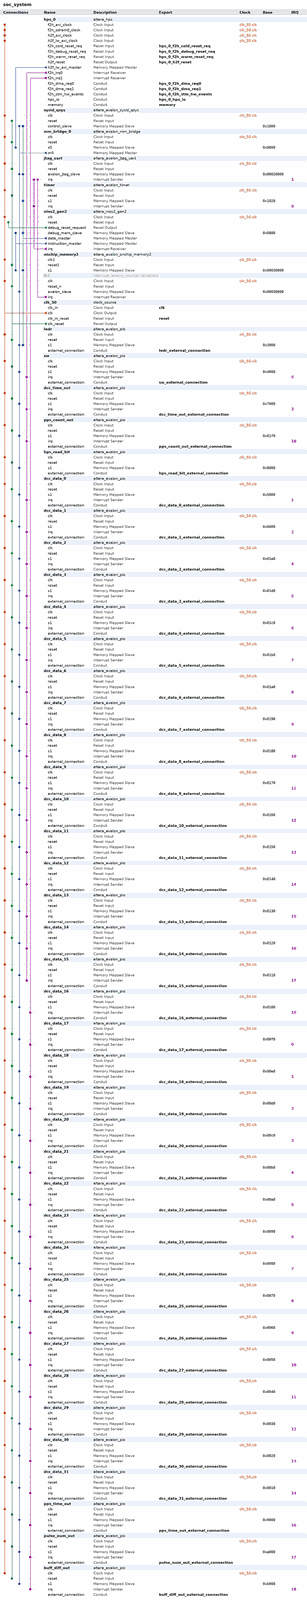
[diagram p0: system contents, whole]
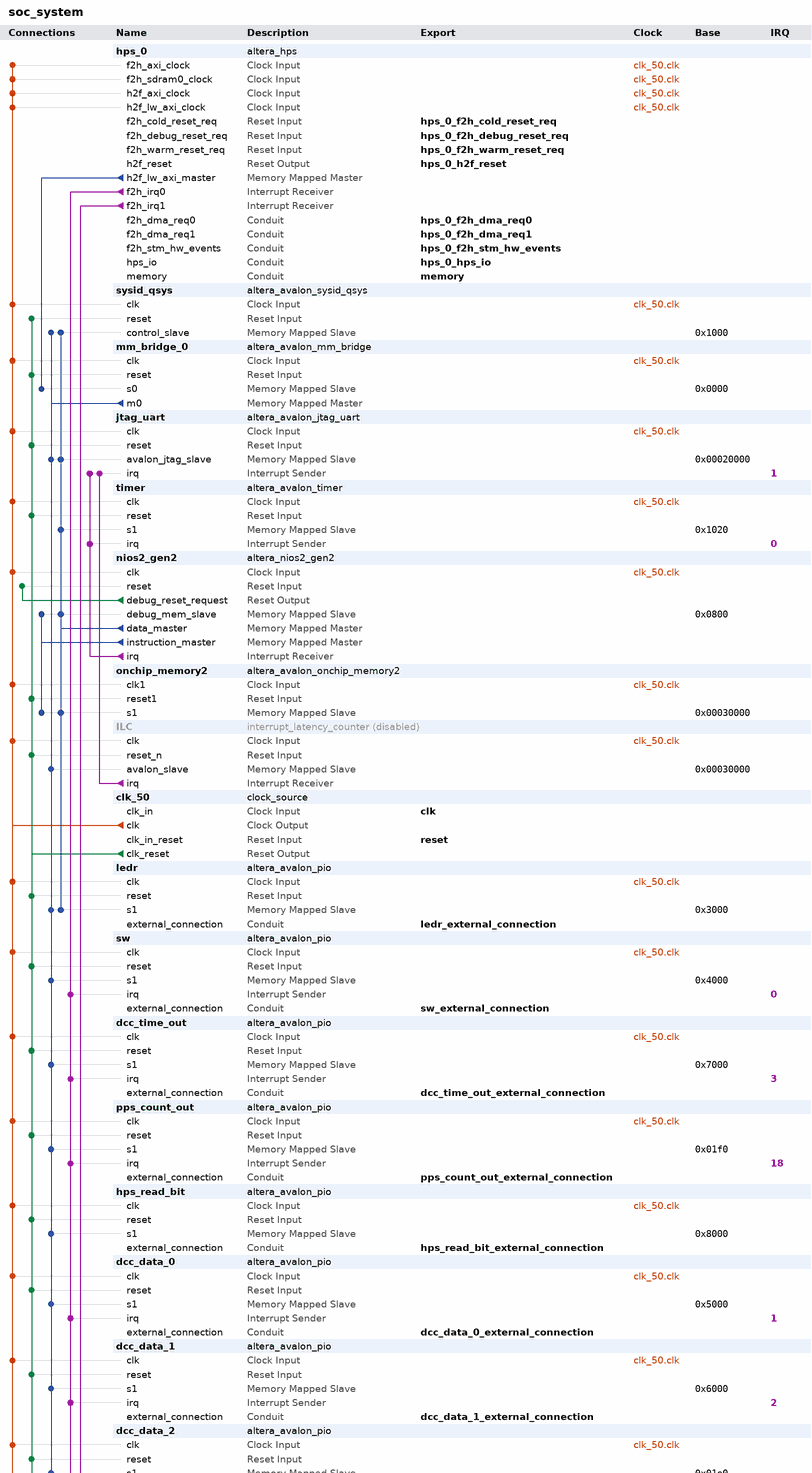
[diagram p1: system contents, upper part]
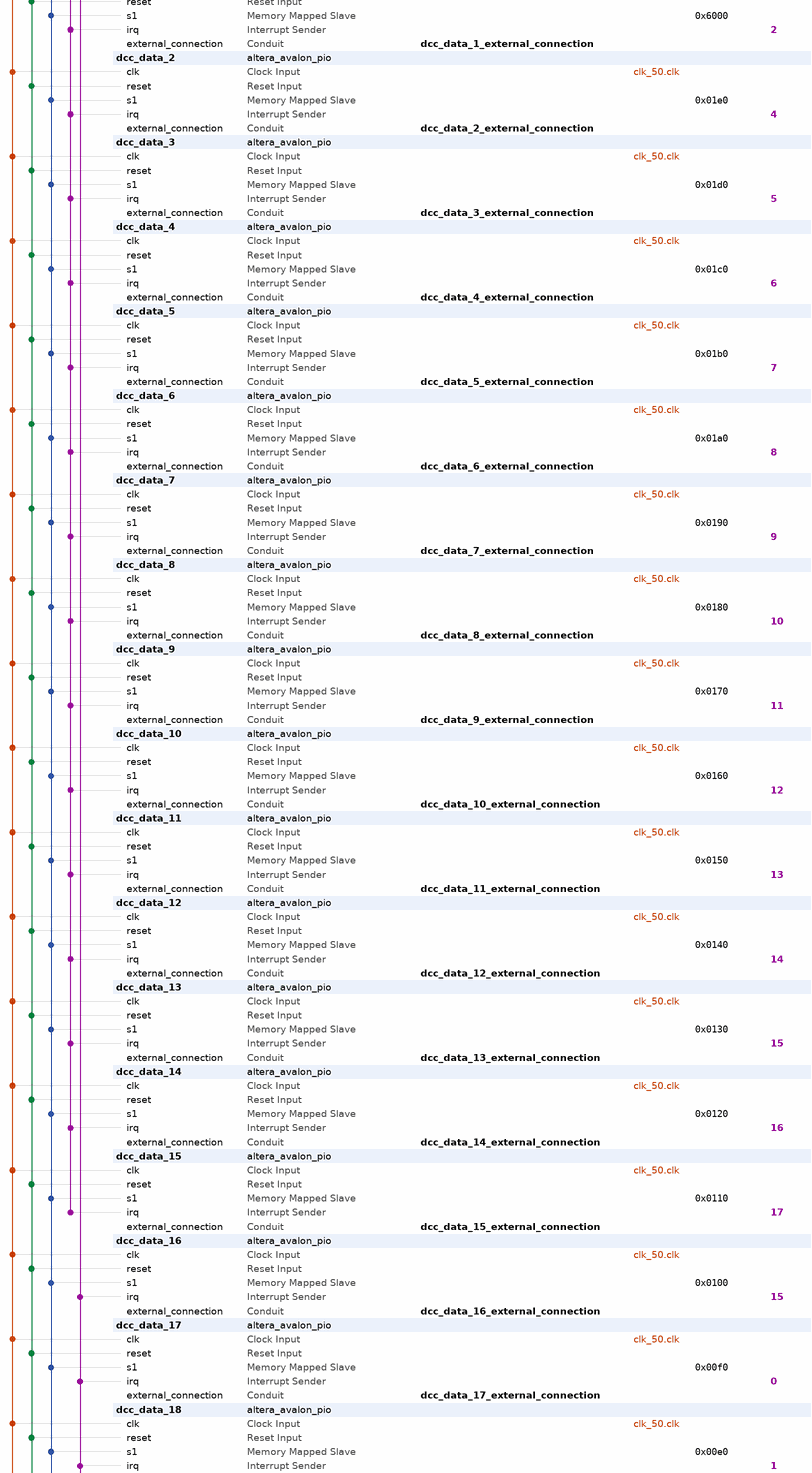
[diagram p2: system contents, middle part]
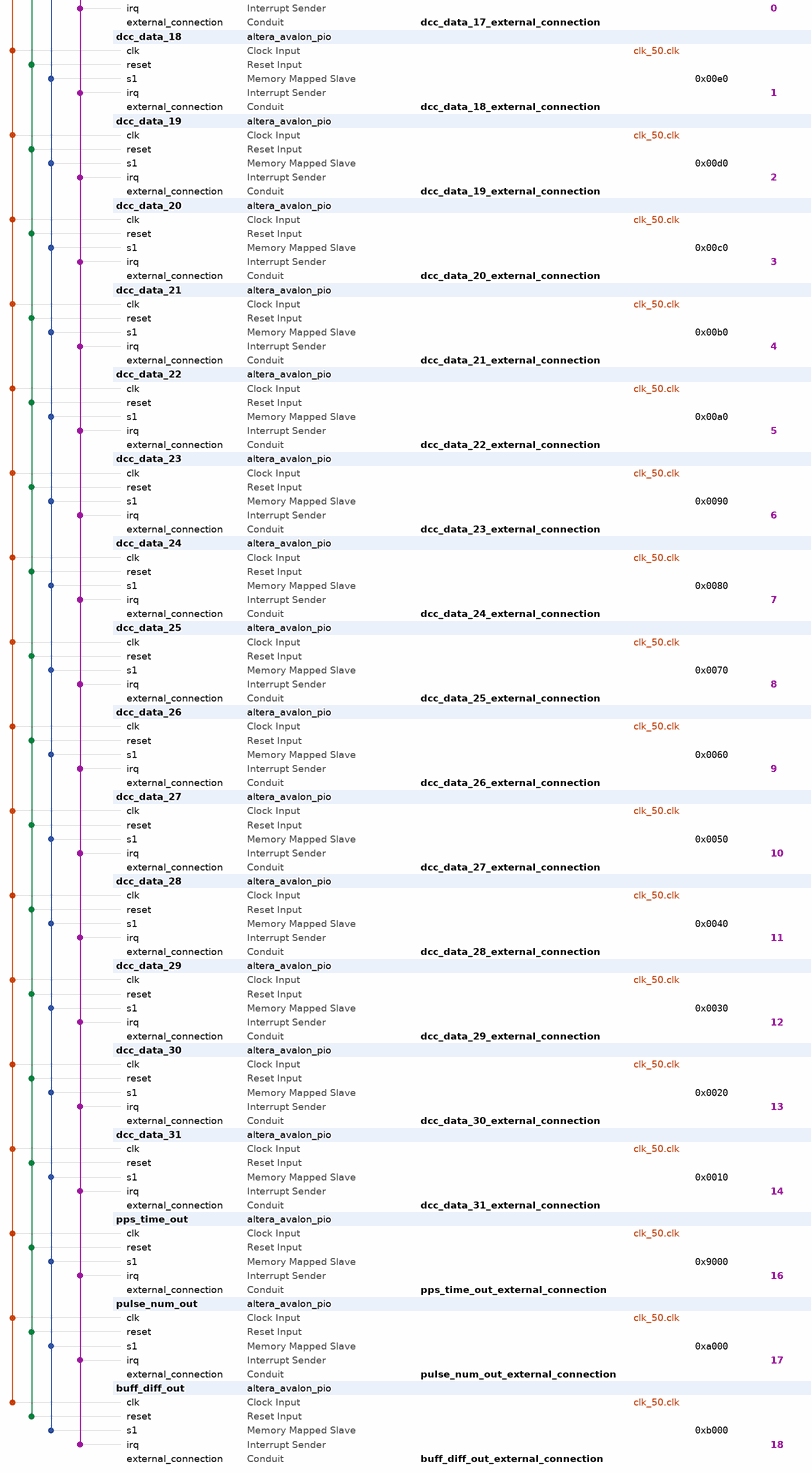
[diagram p3: system contents, lower part]
# Platform Designer (Qsys) system soc_system, Cyclone V 5CSXFC6D6F31C6
# Parameters at their usual value, and those the tool derives, are not listed.
package require -exact qsys 18.1
create_system soc_system
set_project_property DEVICE_FAMILY {Cyclone V}
set_project_property DEVICE 5CSXFC6D6F31C6

add_instance hps_0 altera_hps 18.1
set_instance_parameter_value hps_0 DMA_Enable Yes,Yes,No,No,No,No,No,No
set_instance_parameter_value hps_0 EMAC1_Mode RGMII
set_instance_parameter_value hps_0 EMAC1_PinMuxing {HPS I/O Set 0}
set_instance_parameter_value hps_0 F2SCLK_COLDRST_Enable true
set_instance_parameter_value hps_0 F2SCLK_DBGRST_Enable true
set_instance_parameter_value hps_0 F2SCLK_WARMRST_Enable true
set_instance_parameter_value hps_0 F2SDRAM_Type {Avalon-MM Bidirectional}
set_instance_parameter_value hps_0 F2SDRAM_Width 256
set_instance_parameter_value hps_0 F2SINTERRUPT_Enable true
set_instance_parameter_value hps_0 F2S_Width 3
set_instance_parameter_value hps_0 FPGA_PERIPHERAL_OUTPUT_CLOCK_FREQ_EMAC0_GTX_CLK 100
set_instance_parameter_value hps_0 FPGA_PERIPHERAL_OUTPUT_CLOCK_FREQ_EMAC0_MD_CLK 100.0
set_instance_parameter_value hps_0 FPGA_PERIPHERAL_OUTPUT_CLOCK_FREQ_EMAC1_GTX_CLK 100
set_instance_parameter_value hps_0 FPGA_PERIPHERAL_OUTPUT_CLOCK_FREQ_EMAC1_MD_CLK 100.0
set_instance_parameter_value hps_0 HPS_PROTOCOL DDR3
set_instance_parameter_value hps_0 I2C0_Mode I2C
set_instance_parameter_value hps_0 I2C0_PinMuxing {HPS I/O Set 0}
set_instance_parameter_value hps_0 I2C1_Mode I2C
set_instance_parameter_value hps_0 I2C1_PinMuxing {HPS I/O Set 0}
set_instance_parameter_value hps_0 LWH2F_Enable true
set_instance_parameter_value hps_0 MEM_BANKADDR_WIDTH 3
set_instance_parameter_value hps_0 MEM_CLK_FREQ 400.0
set_instance_parameter_value hps_0 MEM_COL_ADDR_WIDTH 10
set_instance_parameter_value hps_0 MEM_DQ_WIDTH 32
set_instance_parameter_value hps_0 MEM_DRV_STR RZQ/6
set_instance_parameter_value hps_0 MEM_ROW_ADDR_WIDTH 15
set_instance_parameter_value hps_0 MEM_RTT_NOM RZQ/6
set_instance_parameter_value hps_0 MEM_RTT_WR {Dynamic ODT off}
set_instance_parameter_value hps_0 MEM_TCL 7
set_instance_parameter_value hps_0 MEM_TFAW_NS 45.0
set_instance_parameter_value hps_0 MEM_TRAS_NS 36.0
set_instance_parameter_value hps_0 MEM_TRCD_NS 13.125
set_instance_parameter_value hps_0 MEM_TRFC_NS 300.0
set_instance_parameter_value hps_0 MEM_TRP_NS 13.125
set_instance_parameter_value hps_0 MEM_VENDOR Micron
set_instance_parameter_value hps_0 MEM_WTCL 7
set_instance_parameter_value hps_0 QSPI_Mode {1 SS}
set_instance_parameter_value hps_0 QSPI_PinMuxing {HPS I/O Set 0}
set_instance_parameter_value hps_0 REF_CLK_FREQ 25.0
set_instance_parameter_value hps_0 S2FCLK_USER2CLK 1
set_instance_parameter_value hps_0 S2F_Width 2
set_instance_parameter_value hps_0 SDIO_Mode {4-bit Data}
set_instance_parameter_value hps_0 SDIO_PinMuxing {HPS I/O Set 0}
set_instance_parameter_value hps_0 SPIM0_Mode {Single Slave Select}
set_instance_parameter_value hps_0 SPIM0_PinMuxing {HPS I/O Set 0}
set_instance_parameter_value hps_0 SPIM1_Mode {Single Slave Select}
set_instance_parameter_value hps_0 SPIM1_PinMuxing {HPS I/O Set 0}
set_instance_parameter_value hps_0 STM_Enable true
set_instance_parameter_value hps_0 TIMING_BOARD_AC_SKEW 0.02
set_instance_parameter_value hps_0 TIMING_BOARD_AC_TO_CK_SKEW 0.01
set_instance_parameter_value hps_0 TIMING_BOARD_DQ_TO_DQS_SKEW 0.05
set_instance_parameter_value hps_0 TIMING_BOARD_MAX_CK_DELAY 0.03
set_instance_parameter_value hps_0 TIMING_BOARD_MAX_DQS_DELAY 0.02
set_instance_parameter_value hps_0 TIMING_BOARD_SKEW_BETWEEN_DQS 0.06
set_instance_parameter_value hps_0 TIMING_BOARD_SKEW_CKDQS_DIMM_MAX 0.12
set_instance_parameter_value hps_0 TIMING_BOARD_SKEW_CKDQS_DIMM_MIN 0.06
set_instance_parameter_value hps_0 TIMING_BOARD_SKEW_WITHIN_DQS 0.01
set_instance_parameter_value hps_0 TIMING_TDH 65
set_instance_parameter_value hps_0 TIMING_TDQSCK 255
set_instance_parameter_value hps_0 TIMING_TDQSQ 125
set_instance_parameter_value hps_0 TIMING_TDS 30
set_instance_parameter_value hps_0 TIMING_TIH 140
set_instance_parameter_value hps_0 TIMING_TIS 190
set_instance_parameter_value hps_0 TIMING_TQSH 0.4
set_instance_parameter_value hps_0 UART0_Mode {No Flow Control}
set_instance_parameter_value hps_0 UART0_PinMuxing {HPS I/O Set 0}
set_instance_parameter_value hps_0 USB1_Mode SDR
set_instance_parameter_value hps_0 USB1_PinMuxing {HPS I/O Set 0}
set_instance_parameter_value hps_0 desired_cfg_clk_mhz 100.0
set_instance_parameter_value hps_0 desired_mpu_clk_mhz 925.0
set_instance_parameter_value hps_0 desired_qspi_clk_mhz 400.0
set_instance_parameter_value hps_0 use_default_mpu_clk false

add_instance sysid_qsys altera_avalon_sysid_qsys 18.1
set_instance_parameter_value sysid_qsys id -1395322110

add_instance mm_bridge_0 altera_avalon_mm_bridge 18.1
set_instance_parameter_value mm_bridge_0 ADDRESS_UNITS SYMBOLS
set_instance_parameter_value mm_bridge_0 ADDRESS_WIDTH 10
set_instance_parameter_value mm_bridge_0 DATA_WIDTH 32
set_instance_parameter_value mm_bridge_0 MAX_PENDING_RESPONSES 4
set_instance_parameter_value mm_bridge_0 USE_AUTO_ADDRESS_WIDTH 1

add_instance jtag_uart altera_avalon_jtag_uart 18.1
set_instance_parameter_value jtag_uart allowMultipleConnections true
set_instance_parameter_value jtag_uart simInteractiveOptions INTERACTIVE_ASCII_OUTPUT

add_instance timer altera_avalon_timer 18.1
set_instance_parameter_value timer period 1
set_instance_parameter_value timer periodUnits MSEC

add_instance nios2_gen2 altera_nios2_gen2 18.1
set_instance_parameter_value nios2_gen2 dcache_size 2048
set_instance_parameter_value nios2_gen2 exceptionSlave onchip_memory2.s1
set_instance_parameter_value nios2_gen2 icache_size 4096
set_instance_parameter_value nios2_gen2 impl Tiny
set_instance_parameter_value nios2_gen2 resetSlave onchip_memory2.s1

add_instance onchip_memory2 altera_avalon_onchip_memory2 18.1
set_instance_parameter_value onchip_memory2 dataWidth 64
set_instance_parameter_value onchip_memory2 dualPort false
set_instance_parameter_value onchip_memory2 initMemContent true
set_instance_parameter_value onchip_memory2 initializationFileName onchip_memory2
set_instance_parameter_value onchip_memory2 memorySize 65536

add_instance ILC interrupt_latency_counter 18.1
set_instance_property ILC ENABLED false

add_instance clk_50 clock_source 18.1
set_instance_parameter_value clk_50 clockFrequency 50000000

add_instance ledr altera_avalon_pio 18.1
set_instance_parameter_value ledr direction Output
set_instance_parameter_value ledr width 10

add_instance sw altera_avalon_pio 18.1
set_instance_parameter_value sw captureEdge true
set_instance_parameter_value sw direction Input
set_instance_parameter_value sw edgeType ANY
set_instance_parameter_value sw generateIRQ true
set_instance_parameter_value sw irqType EDGE
set_instance_parameter_value sw width 14

add_instance dcc_time_out altera_avalon_pio 18.1
set_instance_parameter_value dcc_time_out captureEdge true
set_instance_parameter_value dcc_time_out direction Input
set_instance_parameter_value dcc_time_out generateIRQ true
set_instance_parameter_value dcc_time_out irqType EDGE
set_instance_parameter_value dcc_time_out width 26

add_instance pps_count_out altera_avalon_pio 18.1
set_instance_parameter_value pps_count_out captureEdge true
set_instance_parameter_value pps_count_out direction Input
set_instance_parameter_value pps_count_out generateIRQ true
set_instance_parameter_value pps_count_out irqType EDGE
set_instance_parameter_value pps_count_out width 32

add_instance hps_read_bit altera_avalon_pio 18.1
set_instance_parameter_value hps_read_bit direction Output
set_instance_parameter_value hps_read_bit width 1

add_instance dcc_data_0 altera_avalon_pio 18.1
set_instance_parameter_value dcc_data_0 captureEdge true
set_instance_parameter_value dcc_data_0 direction Input
set_instance_parameter_value dcc_data_0 generateIRQ true
set_instance_parameter_value dcc_data_0 irqType EDGE
set_instance_parameter_value dcc_data_0 width 32

add_instance dcc_data_1 altera_avalon_pio 18.1
set_instance_parameter_value dcc_data_1 captureEdge true
set_instance_parameter_value dcc_data_1 direction Input
set_instance_parameter_value dcc_data_1 generateIRQ true
set_instance_parameter_value dcc_data_1 irqType EDGE
set_instance_parameter_value dcc_data_1 width 32

add_instance dcc_data_2 altera_avalon_pio 18.1
set_instance_parameter_value dcc_data_2 captureEdge true
set_instance_parameter_value dcc_data_2 direction Input
set_instance_parameter_value dcc_data_2 generateIRQ true
set_instance_parameter_value dcc_data_2 irqType EDGE
set_instance_parameter_value dcc_data_2 width 32

add_instance dcc_data_3 altera_avalon_pio 18.1
set_instance_parameter_value dcc_data_3 captureEdge true
set_instance_parameter_value dcc_data_3 direction Input
set_instance_parameter_value dcc_data_3 generateIRQ true
set_instance_parameter_value dcc_data_3 irqType EDGE
set_instance_parameter_value dcc_data_3 width 32

add_instance dcc_data_4 altera_avalon_pio 18.1
set_instance_parameter_value dcc_data_4 captureEdge true
set_instance_parameter_value dcc_data_4 direction Input
set_instance_parameter_value dcc_data_4 generateIRQ true
set_instance_parameter_value dcc_data_4 irqType EDGE
set_instance_parameter_value dcc_data_4 width 32

add_instance dcc_data_5 altera_avalon_pio 18.1
set_instance_parameter_value dcc_data_5 captureEdge true
set_instance_parameter_value dcc_data_5 direction Input
set_instance_parameter_value dcc_data_5 generateIRQ true
set_instance_parameter_value dcc_data_5 irqType EDGE
set_instance_parameter_value dcc_data_5 width 32

add_instance dcc_data_6 altera_avalon_pio 18.1
set_instance_parameter_value dcc_data_6 captureEdge true
set_instance_parameter_value dcc_data_6 direction Input
set_instance_parameter_value dcc_data_6 generateIRQ true
set_instance_parameter_value dcc_data_6 irqType EDGE
set_instance_parameter_value dcc_data_6 width 32

add_instance dcc_data_7 altera_avalon_pio 18.1
set_instance_parameter_value dcc_data_7 captureEdge true
set_instance_parameter_value dcc_data_7 direction Input
set_instance_parameter_value dcc_data_7 generateIRQ true
set_instance_parameter_value dcc_data_7 irqType EDGE
set_instance_parameter_value dcc_data_7 width 32

add_instance dcc_data_8 altera_avalon_pio 18.1
set_instance_parameter_value dcc_data_8 captureEdge true
set_instance_parameter_value dcc_data_8 direction Input
set_instance_parameter_value dcc_data_8 generateIRQ true
set_instance_parameter_value dcc_data_8 irqType EDGE
set_instance_parameter_value dcc_data_8 width 32

add_instance dcc_data_9 altera_avalon_pio 18.1
set_instance_parameter_value dcc_data_9 captureEdge true
set_instance_parameter_value dcc_data_9 direction Input
set_instance_parameter_value dcc_data_9 generateIRQ true
set_instance_parameter_value dcc_data_9 irqType EDGE
set_instance_parameter_value dcc_data_9 width 32

add_instance dcc_data_10 altera_avalon_pio 18.1
set_instance_parameter_value dcc_data_10 captureEdge true
set_instance_parameter_value dcc_data_10 direction Input
set_instance_parameter_value dcc_data_10 generateIRQ true
set_instance_parameter_value dcc_data_10 irqType EDGE
set_instance_parameter_value dcc_data_10 width 32

add_instance dcc_data_11 altera_avalon_pio 18.1
set_instance_parameter_value dcc_data_11 captureEdge true
set_instance_parameter_value dcc_data_11 direction Input
set_instance_parameter_value dcc_data_11 generateIRQ true
set_instance_parameter_value dcc_data_11 irqType EDGE
set_instance_parameter_value dcc_data_11 width 32

add_instance dcc_data_12 altera_avalon_pio 18.1
set_instance_parameter_value dcc_data_12 captureEdge true
set_instance_parameter_value dcc_data_12 direction Input
set_instance_parameter_value dcc_data_12 generateIRQ true
set_instance_parameter_value dcc_data_12 irqType EDGE
set_instance_parameter_value dcc_data_12 width 32

add_instance dcc_data_13 altera_avalon_pio 18.1
set_instance_parameter_value dcc_data_13 captureEdge true
set_instance_parameter_value dcc_data_13 direction Input
set_instance_parameter_value dcc_data_13 generateIRQ true
set_instance_parameter_value dcc_data_13 irqType EDGE
set_instance_parameter_value dcc_data_13 width 32

add_instance dcc_data_14 altera_avalon_pio 18.1
set_instance_parameter_value dcc_data_14 captureEdge true
set_instance_parameter_value dcc_data_14 direction Input
set_instance_parameter_value dcc_data_14 generateIRQ true
set_instance_parameter_value dcc_data_14 irqType EDGE
set_instance_parameter_value dcc_data_14 width 32

add_instance dcc_data_15 altera_avalon_pio 18.1
set_instance_parameter_value dcc_data_15 captureEdge true
set_instance_parameter_value dcc_data_15 direction Input
set_instance_parameter_value dcc_data_15 generateIRQ true
set_instance_parameter_value dcc_data_15 irqType EDGE
set_instance_parameter_value dcc_data_15 width 32

add_instance dcc_data_16 altera_avalon_pio 18.1
set_instance_parameter_value dcc_data_16 captureEdge true
set_instance_parameter_value dcc_data_16 direction Input
set_instance_parameter_value dcc_data_16 generateIRQ true
set_instance_parameter_value dcc_data_16 irqType EDGE
set_instance_parameter_value dcc_data_16 width 32

add_instance dcc_data_17 altera_avalon_pio 18.1
set_instance_parameter_value dcc_data_17 captureEdge true
set_instance_parameter_value dcc_data_17 direction Input
set_instance_parameter_value dcc_data_17 generateIRQ true
set_instance_parameter_value dcc_data_17 irqType EDGE
set_instance_parameter_value dcc_data_17 width 32

add_instance dcc_data_18 altera_avalon_pio 18.1
set_instance_parameter_value dcc_data_18 captureEdge true
set_instance_parameter_value dcc_data_18 direction Input
set_instance_parameter_value dcc_data_18 generateIRQ true
set_instance_parameter_value dcc_data_18 irqType EDGE
set_instance_parameter_value dcc_data_18 width 32

add_instance dcc_data_19 altera_avalon_pio 18.1
set_instance_parameter_value dcc_data_19 captureEdge true
set_instance_parameter_value dcc_data_19 direction Input
set_instance_parameter_value dcc_data_19 generateIRQ true
set_instance_parameter_value dcc_data_19 irqType EDGE
set_instance_parameter_value dcc_data_19 width 32

add_instance dcc_data_20 altera_avalon_pio 18.1
set_instance_parameter_value dcc_data_20 captureEdge true
set_instance_parameter_value dcc_data_20 direction Input
set_instance_parameter_value dcc_data_20 generateIRQ true
set_instance_parameter_value dcc_data_20 irqType EDGE
set_instance_parameter_value dcc_data_20 width 32

add_instance dcc_data_21 altera_avalon_pio 18.1
set_instance_parameter_value dcc_data_21 captureEdge true
set_instance_parameter_value dcc_data_21 direction Input
set_instance_parameter_value dcc_data_21 generateIRQ true
set_instance_parameter_value dcc_data_21 irqType EDGE
set_instance_parameter_value dcc_data_21 width 32

add_instance dcc_data_22 altera_avalon_pio 18.1
set_instance_parameter_value dcc_data_22 captureEdge true
set_instance_parameter_value dcc_data_22 direction Input
set_instance_parameter_value dcc_data_22 generateIRQ true
set_instance_parameter_value dcc_data_22 irqType EDGE
set_instance_parameter_value dcc_data_22 width 32

add_instance dcc_data_23 altera_avalon_pio 18.1
set_instance_parameter_value dcc_data_23 captureEdge true
set_instance_parameter_value dcc_data_23 direction Input
set_instance_parameter_value dcc_data_23 generateIRQ true
set_instance_parameter_value dcc_data_23 irqType EDGE
set_instance_parameter_value dcc_data_23 width 32

add_instance dcc_data_24 altera_avalon_pio 18.1
set_instance_parameter_value dcc_data_24 captureEdge true
set_instance_parameter_value dcc_data_24 direction Input
set_instance_parameter_value dcc_data_24 generateIRQ true
set_instance_parameter_value dcc_data_24 irqType EDGE
set_instance_parameter_value dcc_data_24 width 32

add_instance dcc_data_25 altera_avalon_pio 18.1
set_instance_parameter_value dcc_data_25 captureEdge true
set_instance_parameter_value dcc_data_25 direction Input
set_instance_parameter_value dcc_data_25 generateIRQ true
set_instance_parameter_value dcc_data_25 irqType EDGE
set_instance_parameter_value dcc_data_25 width 32

add_instance dcc_data_26 altera_avalon_pio 18.1
set_instance_parameter_value dcc_data_26 captureEdge true
set_instance_parameter_value dcc_data_26 direction Input
set_instance_parameter_value dcc_data_26 generateIRQ true
set_instance_parameter_value dcc_data_26 irqType EDGE
set_instance_parameter_value dcc_data_26 width 32

add_instance dcc_data_27 altera_avalon_pio 18.1
set_instance_parameter_value dcc_data_27 captureEdge true
set_instance_parameter_value dcc_data_27 direction Input
set_instance_parameter_value dcc_data_27 generateIRQ true
set_instance_parameter_value dcc_data_27 irqType EDGE
set_instance_parameter_value dcc_data_27 width 32

add_instance dcc_data_28 altera_avalon_pio 18.1
set_instance_parameter_value dcc_data_28 captureEdge true
set_instance_parameter_value dcc_data_28 direction Input
set_instance_parameter_value dcc_data_28 generateIRQ true
set_instance_parameter_value dcc_data_28 irqType EDGE
set_instance_parameter_value dcc_data_28 width 32

add_instance dcc_data_29 altera_avalon_pio 18.1
set_instance_parameter_value dcc_data_29 captureEdge true
set_instance_parameter_value dcc_data_29 direction Input
set_instance_parameter_value dcc_data_29 generateIRQ true
set_instance_parameter_value dcc_data_29 irqType EDGE
set_instance_parameter_value dcc_data_29 width 32

add_instance dcc_data_30 altera_avalon_pio 18.1
set_instance_parameter_value dcc_data_30 captureEdge true
set_instance_parameter_value dcc_data_30 direction Input
set_instance_parameter_value dcc_data_30 generateIRQ true
set_instance_parameter_value dcc_data_30 irqType EDGE
set_instance_parameter_value dcc_data_30 width 32

add_instance dcc_data_31 altera_avalon_pio 18.1
set_instance_parameter_value dcc_data_31 captureEdge true
set_instance_parameter_value dcc_data_31 direction Input
set_instance_parameter_value dcc_data_31 generateIRQ true
set_instance_parameter_value dcc_data_31 irqType EDGE
set_instance_parameter_value dcc_data_31 width 32

add_instance pps_time_out altera_avalon_pio 18.1
set_instance_parameter_value pps_time_out captureEdge true
set_instance_parameter_value pps_time_out direction Input
set_instance_parameter_value pps_time_out generateIRQ true
set_instance_parameter_value pps_time_out irqType EDGE
set_instance_parameter_value pps_time_out width 26

add_instance pulse_num_out altera_avalon_pio 18.1
set_instance_parameter_value pulse_num_out captureEdge true
set_instance_parameter_value pulse_num_out direction Input
set_instance_parameter_value pulse_num_out generateIRQ true
set_instance_parameter_value pulse_num_out irqType EDGE
set_instance_parameter_value pulse_num_out width 32

add_instance buff_diff_out altera_avalon_pio 18.1
set_instance_parameter_value buff_diff_out captureEdge true
set_instance_parameter_value buff_diff_out direction Input
set_instance_parameter_value buff_diff_out generateIRQ true
set_instance_parameter_value buff_diff_out irqType EDGE
set_instance_parameter_value buff_diff_out width 32

# connections
add_connection clk_50.clk buff_diff_out.clk clock
add_connection clk_50.clk dcc_data_0.clk clock
add_connection clk_50.clk dcc_data_1.clk clock
add_connection clk_50.clk dcc_data_2.clk clock
add_connection clk_50.clk dcc_data_3.clk clock
add_connection clk_50.clk dcc_data_4.clk clock
add_connection clk_50.clk dcc_data_5.clk clock
add_connection clk_50.clk dcc_data_6.clk clock
add_connection clk_50.clk dcc_data_7.clk clock
add_connection clk_50.clk dcc_data_8.clk clock
add_connection clk_50.clk dcc_data_9.clk clock
add_connection clk_50.clk dcc_data_10.clk clock
add_connection clk_50.clk dcc_data_11.clk clock
add_connection clk_50.clk dcc_data_12.clk clock
add_connection clk_50.clk dcc_data_13.clk clock
add_connection clk_50.clk dcc_data_14.clk clock
add_connection clk_50.clk dcc_data_15.clk clock
add_connection clk_50.clk dcc_data_16.clk clock
add_connection clk_50.clk dcc_data_17.clk clock
add_connection clk_50.clk dcc_data_18.clk clock
add_connection clk_50.clk dcc_data_19.clk clock
add_connection clk_50.clk dcc_data_20.clk clock
add_connection clk_50.clk dcc_data_21.clk clock
add_connection clk_50.clk dcc_data_22.clk clock
add_connection clk_50.clk dcc_data_23.clk clock
add_connection clk_50.clk dcc_data_24.clk clock
add_connection clk_50.clk dcc_data_25.clk clock
add_connection clk_50.clk dcc_data_26.clk clock
add_connection clk_50.clk dcc_data_27.clk clock
add_connection clk_50.clk dcc_data_28.clk clock
add_connection clk_50.clk dcc_data_29.clk clock
add_connection clk_50.clk dcc_data_30.clk clock
add_connection clk_50.clk dcc_data_31.clk clock
add_connection clk_50.clk dcc_time_out.clk clock
add_connection clk_50.clk hps_0.f2h_axi_clock clock
add_connection clk_50.clk hps_0.f2h_sdram0_clock clock
add_connection clk_50.clk hps_0.h2f_axi_clock clock
add_connection clk_50.clk hps_0.h2f_lw_axi_clock clock
add_connection clk_50.clk hps_read_bit.clk clock
add_connection clk_50.clk ILC.clk clock
add_connection clk_50.clk jtag_uart.clk clock
add_connection clk_50.clk ledr.clk clock
add_connection clk_50.clk mm_bridge_0.clk clock
add_connection clk_50.clk nios2_gen2.clk clock
add_connection clk_50.clk onchip_memory2.clk1 clock
add_connection clk_50.clk pps_count_out.clk clock
add_connection clk_50.clk pps_time_out.clk clock
add_connection clk_50.clk pulse_num_out.clk clock
add_connection clk_50.clk sw.clk clock
add_connection clk_50.clk sysid_qsys.clk clock
add_connection clk_50.clk timer.clk clock
add_connection clk_50.clk_reset buff_diff_out.reset reset
add_connection clk_50.clk_reset dcc_data_0.reset reset
add_connection clk_50.clk_reset dcc_data_1.reset reset
add_connection clk_50.clk_reset dcc_data_2.reset reset
add_connection clk_50.clk_reset dcc_data_3.reset reset
add_connection clk_50.clk_reset dcc_data_4.reset reset
add_connection clk_50.clk_reset dcc_data_5.reset reset
add_connection clk_50.clk_reset dcc_data_6.reset reset
add_connection clk_50.clk_reset dcc_data_7.reset reset
add_connection clk_50.clk_reset dcc_data_8.reset reset
add_connection clk_50.clk_reset dcc_data_9.reset reset
add_connection clk_50.clk_reset dcc_data_10.reset reset
add_connection clk_50.clk_reset dcc_data_11.reset reset
add_connection clk_50.clk_reset dcc_data_12.reset reset
add_connection clk_50.clk_reset dcc_data_13.reset reset
add_connection clk_50.clk_reset dcc_data_14.reset reset
add_connection clk_50.clk_reset dcc_data_15.reset reset
add_connection clk_50.clk_reset dcc_data_16.reset reset
add_connection clk_50.clk_reset dcc_data_17.reset reset
add_connection clk_50.clk_reset dcc_data_18.reset reset
add_connection clk_50.clk_reset dcc_data_19.reset reset
add_connection clk_50.clk_reset dcc_data_20.reset reset
add_connection clk_50.clk_reset dcc_data_21.reset reset
add_connection clk_50.clk_reset dcc_data_22.reset reset
add_connection clk_50.clk_reset dcc_data_23.reset reset
add_connection clk_50.clk_reset dcc_data_24.reset reset
add_connection clk_50.clk_reset dcc_data_25.reset reset
add_connection clk_50.clk_reset dcc_data_26.reset reset
add_connection clk_50.clk_reset dcc_data_27.reset reset
add_connection clk_50.clk_reset dcc_data_28.reset reset
add_connection clk_50.clk_reset dcc_data_29.reset reset
add_connection clk_50.clk_reset dcc_data_30.reset reset
add_connection clk_50.clk_reset dcc_data_31.reset reset
add_connection clk_50.clk_reset dcc_time_out.reset reset
add_connection clk_50.clk_reset hps_read_bit.reset reset
add_connection clk_50.clk_reset ILC.reset_n reset
add_connection clk_50.clk_reset jtag_uart.reset reset
add_connection clk_50.clk_reset ledr.reset reset
add_connection clk_50.clk_reset mm_bridge_0.reset reset
add_connection clk_50.clk_reset onchip_memory2.reset1 reset
add_connection clk_50.clk_reset pps_count_out.reset reset
add_connection clk_50.clk_reset pps_time_out.reset reset
add_connection clk_50.clk_reset pulse_num_out.reset reset
add_connection clk_50.clk_reset sw.reset reset
add_connection clk_50.clk_reset sysid_qsys.reset reset
add_connection clk_50.clk_reset timer.reset reset
add_connection nios2_gen2.debug_reset_request nios2_gen2.reset reset
add_connection hps_0.h2f_lw_axi_master mm_bridge_0.s0 avalon
set_connection_parameter_value hps_0.h2f_lw_axi_master/mm_bridge_0.s0 baseAddress 0x0000
add_connection mm_bridge_0.m0 buff_diff_out.s1 avalon
set_connection_parameter_value mm_bridge_0.m0/buff_diff_out.s1 baseAddress 0xb000
add_connection mm_bridge_0.m0 dcc_data_0.s1 avalon
set_connection_parameter_value mm_bridge_0.m0/dcc_data_0.s1 baseAddress 0x5000
add_connection mm_bridge_0.m0 dcc_data_1.s1 avalon
set_connection_parameter_value mm_bridge_0.m0/dcc_data_1.s1 baseAddress 0x6000
add_connection mm_bridge_0.m0 dcc_data_2.s1 avalon
set_connection_parameter_value mm_bridge_0.m0/dcc_data_2.s1 baseAddress 0x01e0
add_connection mm_bridge_0.m0 dcc_data_3.s1 avalon
set_connection_parameter_value mm_bridge_0.m0/dcc_data_3.s1 baseAddress 0x01d0
add_connection mm_bridge_0.m0 dcc_data_4.s1 avalon
set_connection_parameter_value mm_bridge_0.m0/dcc_data_4.s1 baseAddress 0x01c0
add_connection mm_bridge_0.m0 dcc_data_5.s1 avalon
set_connection_parameter_value mm_bridge_0.m0/dcc_data_5.s1 baseAddress 0x01b0
add_connection mm_bridge_0.m0 dcc_data_6.s1 avalon
set_connection_parameter_value mm_bridge_0.m0/dcc_data_6.s1 baseAddress 0x01a0
add_connection mm_bridge_0.m0 dcc_data_7.s1 avalon
set_connection_parameter_value mm_bridge_0.m0/dcc_data_7.s1 baseAddress 0x0190
add_connection mm_bridge_0.m0 dcc_data_8.s1 avalon
set_connection_parameter_value mm_bridge_0.m0/dcc_data_8.s1 baseAddress 0x0180
add_connection mm_bridge_0.m0 dcc_data_9.s1 avalon
set_connection_parameter_value mm_bridge_0.m0/dcc_data_9.s1 baseAddress 0x0170
add_connection mm_bridge_0.m0 dcc_data_10.s1 avalon
set_connection_parameter_value mm_bridge_0.m0/dcc_data_10.s1 baseAddress 0x0160
add_connection mm_bridge_0.m0 dcc_data_11.s1 avalon
set_connection_parameter_value mm_bridge_0.m0/dcc_data_11.s1 baseAddress 0x0150
add_connection mm_bridge_0.m0 dcc_data_12.s1 avalon
set_connection_parameter_value mm_bridge_0.m0/dcc_data_12.s1 baseAddress 0x0140
add_connection mm_bridge_0.m0 dcc_data_13.s1 avalon
set_connection_parameter_value mm_bridge_0.m0/dcc_data_13.s1 baseAddress 0x0130
add_connection mm_bridge_0.m0 dcc_data_14.s1 avalon
set_connection_parameter_value mm_bridge_0.m0/dcc_data_14.s1 baseAddress 0x0120
add_connection mm_bridge_0.m0 dcc_data_15.s1 avalon
set_connection_parameter_value mm_bridge_0.m0/dcc_data_15.s1 baseAddress 0x0110
add_connection mm_bridge_0.m0 dcc_data_16.s1 avalon
set_connection_parameter_value mm_bridge_0.m0/dcc_data_16.s1 baseAddress 0x0100
add_connection mm_bridge_0.m0 dcc_data_17.s1 avalon
set_connection_parameter_value mm_bridge_0.m0/dcc_data_17.s1 baseAddress 0x00f0
add_connection mm_bridge_0.m0 dcc_data_18.s1 avalon
set_connection_parameter_value mm_bridge_0.m0/dcc_data_18.s1 baseAddress 0x00e0
add_connection mm_bridge_0.m0 dcc_data_19.s1 avalon
set_connection_parameter_value mm_bridge_0.m0/dcc_data_19.s1 baseAddress 0x00d0
add_connection mm_bridge_0.m0 dcc_data_20.s1 avalon
set_connection_parameter_value mm_bridge_0.m0/dcc_data_20.s1 baseAddress 0x00c0
add_connection mm_bridge_0.m0 dcc_data_21.s1 avalon
set_connection_parameter_value mm_bridge_0.m0/dcc_data_21.s1 baseAddress 0x00b0
add_connection mm_bridge_0.m0 dcc_data_22.s1 avalon
set_connection_parameter_value mm_bridge_0.m0/dcc_data_22.s1 baseAddress 0x00a0
add_connection mm_bridge_0.m0 dcc_data_23.s1 avalon
set_connection_parameter_value mm_bridge_0.m0/dcc_data_23.s1 baseAddress 0x0090
add_connection mm_bridge_0.m0 dcc_data_24.s1 avalon
set_connection_parameter_value mm_bridge_0.m0/dcc_data_24.s1 baseAddress 0x0080
add_connection mm_bridge_0.m0 dcc_data_25.s1 avalon
set_connection_parameter_value mm_bridge_0.m0/dcc_data_25.s1 baseAddress 0x0070
add_connection mm_bridge_0.m0 dcc_data_26.s1 avalon
set_connection_parameter_value mm_bridge_0.m0/dcc_data_26.s1 baseAddress 0x0060
add_connection mm_bridge_0.m0 dcc_data_27.s1 avalon
set_connection_parameter_value mm_bridge_0.m0/dcc_data_27.s1 baseAddress 0x0050
add_connection mm_bridge_0.m0 dcc_data_28.s1 avalon
set_connection_parameter_value mm_bridge_0.m0/dcc_data_28.s1 baseAddress 0x0040
add_connection mm_bridge_0.m0 dcc_data_29.s1 avalon
set_connection_parameter_value mm_bridge_0.m0/dcc_data_29.s1 baseAddress 0x0030
add_connection mm_bridge_0.m0 dcc_data_30.s1 avalon
set_connection_parameter_value mm_bridge_0.m0/dcc_data_30.s1 baseAddress 0x0020
add_connection mm_bridge_0.m0 dcc_data_31.s1 avalon
set_connection_parameter_value mm_bridge_0.m0/dcc_data_31.s1 baseAddress 0x0010
add_connection mm_bridge_0.m0 dcc_time_out.s1 avalon
set_connection_parameter_value mm_bridge_0.m0/dcc_time_out.s1 baseAddress 0x7000
add_connection mm_bridge_0.m0 hps_read_bit.s1 avalon
set_connection_parameter_value mm_bridge_0.m0/hps_read_bit.s1 baseAddress 0x8000
add_connection mm_bridge_0.m0 ILC.avalon_slave avalon
set_connection_parameter_value mm_bridge_0.m0/ILC.avalon_slave baseAddress 0x00030000
add_connection mm_bridge_0.m0 jtag_uart.avalon_jtag_slave avalon
set_connection_parameter_value mm_bridge_0.m0/jtag_uart.avalon_jtag_slave baseAddress 0x00020000
add_connection mm_bridge_0.m0 ledr.s1 avalon
set_connection_parameter_value mm_bridge_0.m0/ledr.s1 baseAddress 0x3000
add_connection mm_bridge_0.m0 pps_count_out.s1 avalon
set_connection_parameter_value mm_bridge_0.m0/pps_count_out.s1 baseAddress 0x01f0
add_connection mm_bridge_0.m0 pps_time_out.s1 avalon
set_connection_parameter_value mm_bridge_0.m0/pps_time_out.s1 baseAddress 0x9000
add_connection mm_bridge_0.m0 pulse_num_out.s1 avalon
set_connection_parameter_value mm_bridge_0.m0/pulse_num_out.s1 baseAddress 0xa000
add_connection mm_bridge_0.m0 sw.s1 avalon
set_connection_parameter_value mm_bridge_0.m0/sw.s1 baseAddress 0x4000
add_connection mm_bridge_0.m0 sysid_qsys.control_slave avalon
set_connection_parameter_value mm_bridge_0.m0/sysid_qsys.control_slave baseAddress 0x1000
add_connection nios2_gen2.data_master jtag_uart.avalon_jtag_slave avalon
set_connection_parameter_value nios2_gen2.data_master/jtag_uart.avalon_jtag_slave baseAddress 0x00020000
add_connection nios2_gen2.data_master ledr.s1 avalon
set_connection_parameter_value nios2_gen2.data_master/ledr.s1 baseAddress 0x3000
add_connection nios2_gen2.data_master nios2_gen2.debug_mem_slave avalon
set_connection_parameter_value nios2_gen2.data_master/nios2_gen2.debug_mem_slave baseAddress 0x0800
add_connection nios2_gen2.data_master onchip_memory2.s1 avalon
set_connection_parameter_value nios2_gen2.data_master/onchip_memory2.s1 baseAddress 0x00030000
add_connection nios2_gen2.data_master sysid_qsys.control_slave avalon
set_connection_parameter_value nios2_gen2.data_master/sysid_qsys.control_slave baseAddress 0x1000
add_connection nios2_gen2.data_master timer.s1 avalon
set_connection_parameter_value nios2_gen2.data_master/timer.s1 baseAddress 0x1020
add_connection nios2_gen2.instruction_master nios2_gen2.debug_mem_slave avalon
set_connection_parameter_value nios2_gen2.instruction_master/nios2_gen2.debug_mem_slave baseAddress 0x0800
add_connection nios2_gen2.instruction_master onchip_memory2.s1 avalon
set_connection_parameter_value nios2_gen2.instruction_master/onchip_memory2.s1 baseAddress 0x00030000
add_connection hps_0.f2h_irq0 dcc_data_0.irq interrupt
set_connection_parameter_value hps_0.f2h_irq0/dcc_data_0.irq irqNumber 1
add_connection hps_0.f2h_irq0 dcc_data_1.irq interrupt
set_connection_parameter_value hps_0.f2h_irq0/dcc_data_1.irq irqNumber 2
add_connection hps_0.f2h_irq0 dcc_data_2.irq interrupt
set_connection_parameter_value hps_0.f2h_irq0/dcc_data_2.irq irqNumber 4
add_connection hps_0.f2h_irq0 dcc_data_3.irq interrupt
set_connection_parameter_value hps_0.f2h_irq0/dcc_data_3.irq irqNumber 5
add_connection hps_0.f2h_irq0 dcc_data_4.irq interrupt
set_connection_parameter_value hps_0.f2h_irq0/dcc_data_4.irq irqNumber 6
add_connection hps_0.f2h_irq0 dcc_data_5.irq interrupt
set_connection_parameter_value hps_0.f2h_irq0/dcc_data_5.irq irqNumber 7
add_connection hps_0.f2h_irq0 dcc_data_6.irq interrupt
set_connection_parameter_value hps_0.f2h_irq0/dcc_data_6.irq irqNumber 8
add_connection hps_0.f2h_irq0 dcc_data_7.irq interrupt
set_connection_parameter_value hps_0.f2h_irq0/dcc_data_7.irq irqNumber 9
add_connection hps_0.f2h_irq0 dcc_data_8.irq interrupt
set_connection_parameter_value hps_0.f2h_irq0/dcc_data_8.irq irqNumber 10
add_connection hps_0.f2h_irq0 dcc_data_9.irq interrupt
set_connection_parameter_value hps_0.f2h_irq0/dcc_data_9.irq irqNumber 11
add_connection hps_0.f2h_irq0 dcc_data_10.irq interrupt
set_connection_parameter_value hps_0.f2h_irq0/dcc_data_10.irq irqNumber 12
add_connection hps_0.f2h_irq0 dcc_data_11.irq interrupt
set_connection_parameter_value hps_0.f2h_irq0/dcc_data_11.irq irqNumber 13
add_connection hps_0.f2h_irq0 dcc_data_12.irq interrupt
set_connection_parameter_value hps_0.f2h_irq0/dcc_data_12.irq irqNumber 14
add_connection hps_0.f2h_irq0 dcc_data_13.irq interrupt
set_connection_parameter_value hps_0.f2h_irq0/dcc_data_13.irq irqNumber 15
add_connection hps_0.f2h_irq0 dcc_data_14.irq interrupt
set_connection_parameter_value hps_0.f2h_irq0/dcc_data_14.irq irqNumber 16
add_connection hps_0.f2h_irq0 dcc_data_15.irq interrupt
set_connection_parameter_value hps_0.f2h_irq0/dcc_data_15.irq irqNumber 17
add_connection hps_0.f2h_irq0 dcc_time_out.irq interrupt
set_connection_parameter_value hps_0.f2h_irq0/dcc_time_out.irq irqNumber 3
add_connection hps_0.f2h_irq0 pps_count_out.irq interrupt
set_connection_parameter_value hps_0.f2h_irq0/pps_count_out.irq irqNumber 18
add_connection hps_0.f2h_irq0 sw.irq interrupt
set_connection_parameter_value hps_0.f2h_irq0/sw.irq irqNumber 0
add_connection hps_0.f2h_irq1 buff_diff_out.irq interrupt
set_connection_parameter_value hps_0.f2h_irq1/buff_diff_out.irq irqNumber 18
add_connection hps_0.f2h_irq1 dcc_data_16.irq interrupt
set_connection_parameter_value hps_0.f2h_irq1/dcc_data_16.irq irqNumber 15
add_connection hps_0.f2h_irq1 dcc_data_17.irq interrupt
set_connection_parameter_value hps_0.f2h_irq1/dcc_data_17.irq irqNumber 0
add_connection hps_0.f2h_irq1 dcc_data_18.irq interrupt
set_connection_parameter_value hps_0.f2h_irq1/dcc_data_18.irq irqNumber 1
add_connection hps_0.f2h_irq1 dcc_data_19.irq interrupt
set_connection_parameter_value hps_0.f2h_irq1/dcc_data_19.irq irqNumber 2
add_connection hps_0.f2h_irq1 dcc_data_20.irq interrupt
set_connection_parameter_value hps_0.f2h_irq1/dcc_data_20.irq irqNumber 3
add_connection hps_0.f2h_irq1 dcc_data_21.irq interrupt
set_connection_parameter_value hps_0.f2h_irq1/dcc_data_21.irq irqNumber 4
add_connection hps_0.f2h_irq1 dcc_data_22.irq interrupt
set_connection_parameter_value hps_0.f2h_irq1/dcc_data_22.irq irqNumber 5
add_connection hps_0.f2h_irq1 dcc_data_23.irq interrupt
set_connection_parameter_value hps_0.f2h_irq1/dcc_data_23.irq irqNumber 6
add_connection hps_0.f2h_irq1 dcc_data_24.irq interrupt
set_connection_parameter_value hps_0.f2h_irq1/dcc_data_24.irq irqNumber 7
add_connection hps_0.f2h_irq1 dcc_data_25.irq interrupt
set_connection_parameter_value hps_0.f2h_irq1/dcc_data_25.irq irqNumber 8
add_connection hps_0.f2h_irq1 dcc_data_26.irq interrupt
set_connection_parameter_value hps_0.f2h_irq1/dcc_data_26.irq irqNumber 9
add_connection hps_0.f2h_irq1 dcc_data_27.irq interrupt
set_connection_parameter_value hps_0.f2h_irq1/dcc_data_27.irq irqNumber 10
add_connection hps_0.f2h_irq1 dcc_data_28.irq interrupt
set_connection_parameter_value hps_0.f2h_irq1/dcc_data_28.irq irqNumber 11
add_connection hps_0.f2h_irq1 dcc_data_29.irq interrupt
set_connection_parameter_value hps_0.f2h_irq1/dcc_data_29.irq irqNumber 12
add_connection hps_0.f2h_irq1 dcc_data_30.irq interrupt
set_connection_parameter_value hps_0.f2h_irq1/dcc_data_30.irq irqNumber 13
add_connection hps_0.f2h_irq1 dcc_data_31.irq interrupt
set_connection_parameter_value hps_0.f2h_irq1/dcc_data_31.irq irqNumber 14
add_connection hps_0.f2h_irq1 pps_time_out.irq interrupt
set_connection_parameter_value hps_0.f2h_irq1/pps_time_out.irq irqNumber 16
add_connection hps_0.f2h_irq1 pulse_num_out.irq interrupt
set_connection_parameter_value hps_0.f2h_irq1/pulse_num_out.irq irqNumber 17
add_connection ILC.irq jtag_uart.irq interrupt
set_connection_parameter_value ILC.irq/jtag_uart.irq irqNumber 0
add_connection nios2_gen2.irq jtag_uart.irq interrupt
set_connection_parameter_value nios2_gen2.irq/jtag_uart.irq irqNumber 1
add_connection nios2_gen2.irq timer.irq interrupt
set_connection_parameter_value nios2_gen2.irq/timer.irq irqNumber 0

# exported interfaces
add_interface buff_diff_out_external_connection conduit end
set_interface_property buff_diff_out_external_connection EXPORT_OF buff_diff_out.external_connection
add_interface clk clock sink
set_interface_property clk EXPORT_OF clk_50.clk_in
add_interface dcc_data_0_external_connection conduit end
set_interface_property dcc_data_0_external_connection EXPORT_OF dcc_data_0.external_connection
add_interface dcc_data_10_external_connection conduit end
set_interface_property dcc_data_10_external_connection EXPORT_OF dcc_data_10.external_connection
add_interface dcc_data_11_external_connection conduit end
set_interface_property dcc_data_11_external_connection EXPORT_OF dcc_data_11.external_connection
add_interface dcc_data_12_external_connection conduit end
set_interface_property dcc_data_12_external_connection EXPORT_OF dcc_data_12.external_connection
add_interface dcc_data_13_external_connection conduit end
set_interface_property dcc_data_13_external_connection EXPORT_OF dcc_data_13.external_connection
add_interface dcc_data_14_external_connection conduit end
set_interface_property dcc_data_14_external_connection EXPORT_OF dcc_data_14.external_connection
add_interface dcc_data_15_external_connection conduit end
set_interface_property dcc_data_15_external_connection EXPORT_OF dcc_data_15.external_connection
add_interface dcc_data_16_external_connection conduit end
set_interface_property dcc_data_16_external_connection EXPORT_OF dcc_data_16.external_connection
add_interface dcc_data_17_external_connection conduit end
set_interface_property dcc_data_17_external_connection EXPORT_OF dcc_data_17.external_connection
add_interface dcc_data_18_external_connection conduit end
set_interface_property dcc_data_18_external_connection EXPORT_OF dcc_data_18.external_connection
add_interface dcc_data_19_external_connection conduit end
set_interface_property dcc_data_19_external_connection EXPORT_OF dcc_data_19.external_connection
add_interface dcc_data_1_external_connection conduit end
set_interface_property dcc_data_1_external_connection EXPORT_OF dcc_data_1.external_connection
add_interface dcc_data_20_external_connection conduit end
set_interface_property dcc_data_20_external_connection EXPORT_OF dcc_data_20.external_connection
add_interface dcc_data_21_external_connection conduit end
set_interface_property dcc_data_21_external_connection EXPORT_OF dcc_data_21.external_connection
add_interface dcc_data_22_external_connection conduit end
set_interface_property dcc_data_22_external_connection EXPORT_OF dcc_data_22.external_connection
add_interface dcc_data_23_external_connection conduit end
set_interface_property dcc_data_23_external_connection EXPORT_OF dcc_data_23.external_connection
add_interface dcc_data_24_external_connection conduit end
set_interface_property dcc_data_24_external_connection EXPORT_OF dcc_data_24.external_connection
add_interface dcc_data_25_external_connection conduit end
set_interface_property dcc_data_25_external_connection EXPORT_OF dcc_data_25.external_connection
add_interface dcc_data_26_external_connection conduit end
set_interface_property dcc_data_26_external_connection EXPORT_OF dcc_data_26.external_connection
add_interface dcc_data_27_external_connection conduit end
set_interface_property dcc_data_27_external_connection EXPORT_OF dcc_data_27.external_connection
add_interface dcc_data_28_external_connection conduit end
set_interface_property dcc_data_28_external_connection EXPORT_OF dcc_data_28.external_connection
add_interface dcc_data_29_external_connection conduit end
set_interface_property dcc_data_29_external_connection EXPORT_OF dcc_data_29.external_connection
add_interface dcc_data_2_external_connection conduit end
set_interface_property dcc_data_2_external_connection EXPORT_OF dcc_data_2.external_connection
add_interface dcc_data_30_external_connection conduit end
set_interface_property dcc_data_30_external_connection EXPORT_OF dcc_data_30.external_connection
add_interface dcc_data_31_external_connection conduit end
set_interface_property dcc_data_31_external_connection EXPORT_OF dcc_data_31.external_connection
add_interface dcc_data_3_external_connection conduit end
set_interface_property dcc_data_3_external_connection EXPORT_OF dcc_data_3.external_connection
add_interface dcc_data_4_external_connection conduit end
set_interface_property dcc_data_4_external_connection EXPORT_OF dcc_data_4.external_connection
add_interface dcc_data_5_external_connection conduit end
set_interface_property dcc_data_5_external_connection EXPORT_OF dcc_data_5.external_connection
add_interface dcc_data_6_external_connection conduit end
set_interface_property dcc_data_6_external_connection EXPORT_OF dcc_data_6.external_connection
add_interface dcc_data_7_external_connection conduit end
set_interface_property dcc_data_7_external_connection EXPORT_OF dcc_data_7.external_connection
add_interface dcc_data_8_external_connection conduit end
set_interface_property dcc_data_8_external_connection EXPORT_OF dcc_data_8.external_connection
add_interface dcc_data_9_external_connection conduit end
set_interface_property dcc_data_9_external_connection EXPORT_OF dcc_data_9.external_connection
add_interface dcc_time_out_external_connection conduit end
set_interface_property dcc_time_out_external_connection EXPORT_OF dcc_time_out.external_connection
add_interface hps_0_f2h_cold_reset_req reset sink
set_interface_property hps_0_f2h_cold_reset_req EXPORT_OF hps_0.f2h_cold_reset_req
add_interface hps_0_f2h_debug_reset_req reset sink
set_interface_property hps_0_f2h_debug_reset_req EXPORT_OF hps_0.f2h_debug_reset_req
add_interface hps_0_f2h_dma_req0 conduit end
set_interface_property hps_0_f2h_dma_req0 EXPORT_OF hps_0.f2h_dma_req0
add_interface hps_0_f2h_dma_req1 conduit end
set_interface_property hps_0_f2h_dma_req1 EXPORT_OF hps_0.f2h_dma_req1
add_interface hps_0_f2h_stm_hw_events conduit end
set_interface_property hps_0_f2h_stm_hw_events EXPORT_OF hps_0.f2h_stm_hw_events
add_interface hps_0_f2h_warm_reset_req reset sink
set_interface_property hps_0_f2h_warm_reset_req EXPORT_OF hps_0.f2h_warm_reset_req
add_interface hps_0_h2f_reset reset source
set_interface_property hps_0_h2f_reset EXPORT_OF hps_0.h2f_reset
add_interface hps_0_hps_io conduit end
set_interface_property hps_0_hps_io EXPORT_OF hps_0.hps_io
add_interface hps_read_bit_external_connection conduit end
set_interface_property hps_read_bit_external_connection EXPORT_OF hps_read_bit.external_connection
add_interface ledr_external_connection conduit end
set_interface_property ledr_external_connection EXPORT_OF ledr.external_connection
add_interface memory conduit end
set_interface_property memory EXPORT_OF hps_0.memory
add_interface pps_count_out_external_connection conduit end
set_interface_property pps_count_out_external_connection EXPORT_OF pps_count_out.external_connection
add_interface pps_time_out_external_connection conduit end
set_interface_property pps_time_out_external_connection EXPORT_OF pps_time_out.external_connection
add_interface pulse_num_out_external_connection conduit end
set_interface_property pulse_num_out_external_connection EXPORT_OF pulse_num_out.external_connection
add_interface reset reset sink
set_interface_property reset EXPORT_OF clk_50.clk_in_reset
add_interface sw_external_connection conduit end
set_interface_property sw_external_connection EXPORT_OF sw.external_connection

set_interconnect_requirement {$system} qsys_mm.clockCrossingAdapter HANDSHAKE
set_interconnect_requirement {$system} qsys_mm.maxAdditionalLatency 1

save_system soc_system.qsys
